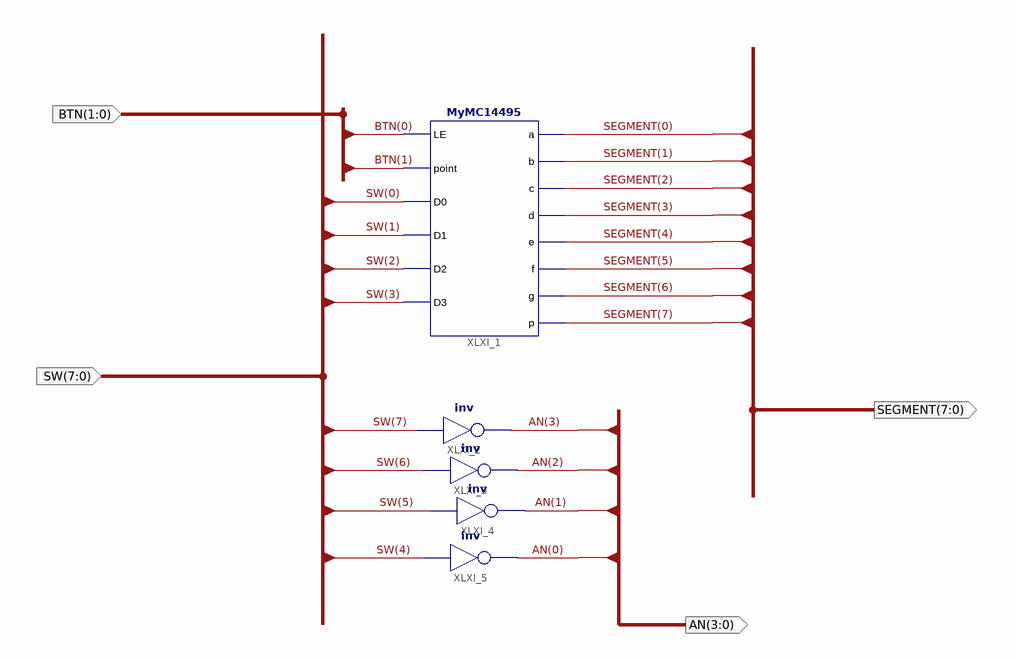
[diagram p0: schematic sheet 1]
// Xilinx ISE schematic MyMC14495_Test.sch (kintex7) as structural Verilog: 5 symbols, 4 ports
module MyMC14495_Test (
  input  [7:0] SW,
  input  [1:0] BTN,
  output [7:0] SEGMENT,
  output [3:0] AN
);

  MyMC14495 XLXI_1 (
    .LE(BTN[0]), .point(BTN[1]), .D0(SW[0]), .D1(SW[1]), .D2(SW[2]), .D3(SW[3]), .a(SEGMENT[0]),
    .b(SEGMENT[1]), .c(SEGMENT[2]), .d(SEGMENT[3]), .e(SEGMENT[4]), .f(SEGMENT[5]), .g(SEGMENT[6]),
    .p(SEGMENT[7]));
  not XLXI_2 (AN[3], SW[7]);
  not XLXI_3 (AN[2], SW[6]);
  not XLXI_4 (AN[1], SW[5]);
  not XLXI_5 (AN[0], SW[4]);
endmodule
